# Altium project ModuloIndividualPlaza.PrjPcb
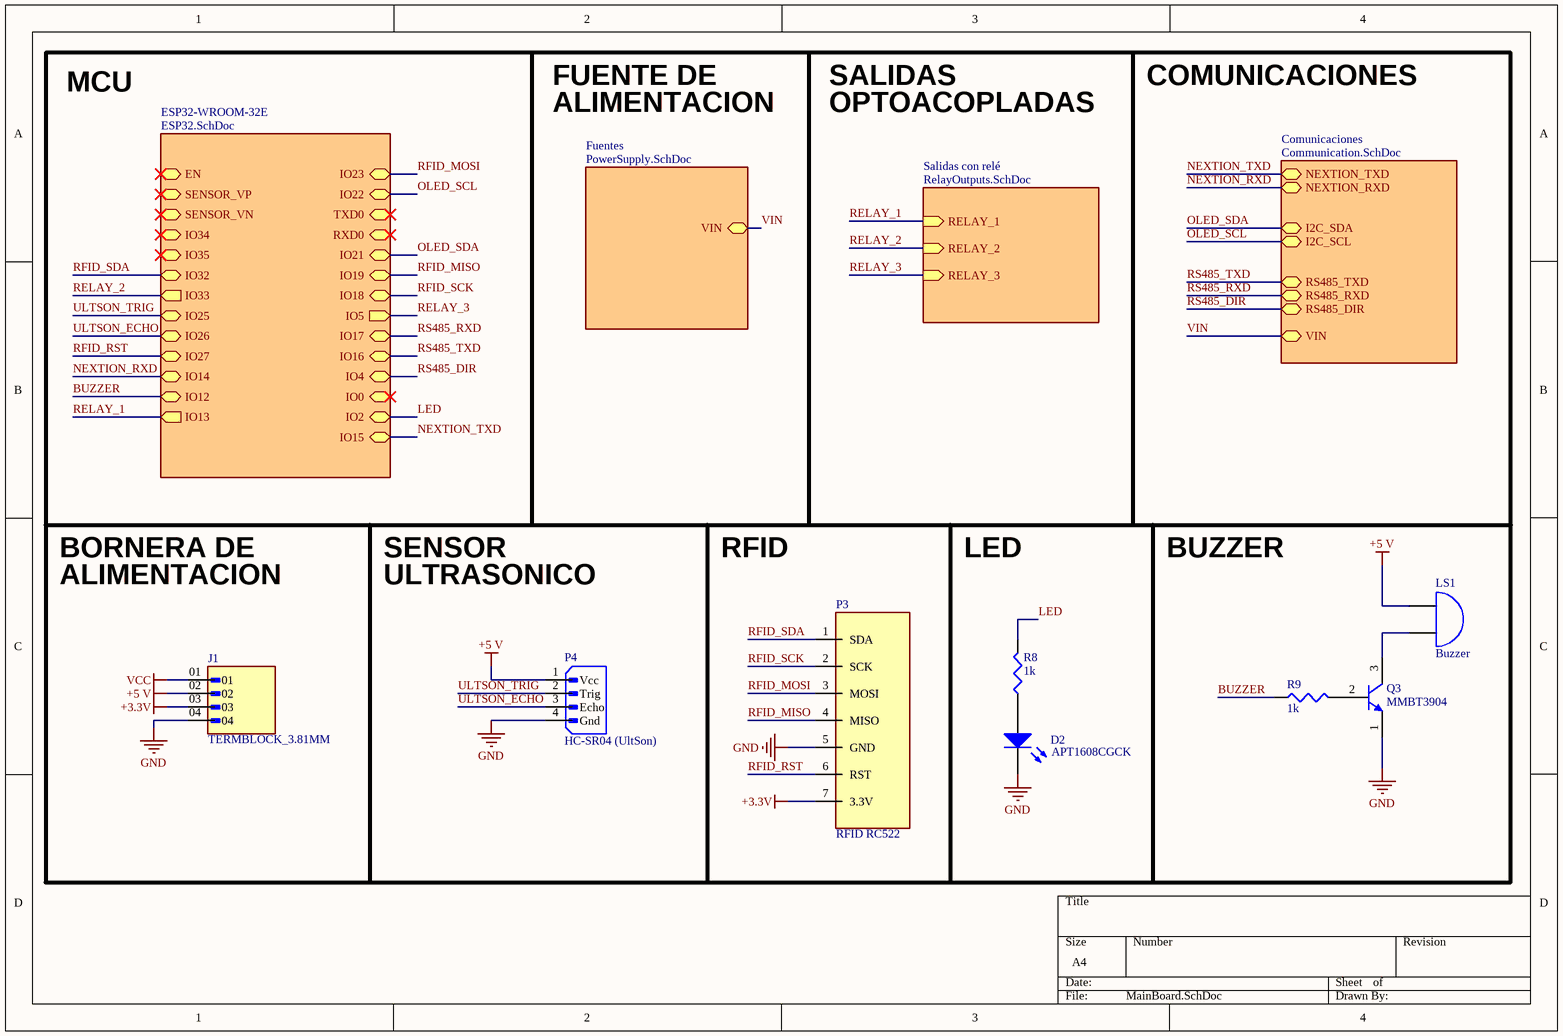
[diagram p0: MainBoard.SchDoc]
5 sheets, 77 parts. Net scope: hierarchical (ports join the sheet entries above them; power ports are global).
Board file: PCB1.PcbDoc
Sheets:
  MainBoard.SchDoc
    ESP32-WROOM-32E = ESP32.SchDoc
    Fuentes = PowerSupply.SchDoc
    Salidas con relé = RelayOutputs.SchDoc
    Comunicaciones = Communication.SchDoc

## Sheet MainBoard.SchDoc
size A4

### Parts
D2  APT1608CGCK  [ChipDiode1608]
J1  TERMBLOCK_3.81MM  [TERMBLOCK_3.81MM_90DEG_4POS]
LS1  Buzzer  [BUZZER]
P3  RFID RC522  [MOD_RFID_RC522]
P4  HC-SR04 (UltSon)  [CONN-B4B-XH-A]
Q3  MMBT3904  [MMBT3904]
R8  1k  [RESC2012N]
R9  1k  [RESC2012N]

### Sub-sheets
Comunicaciones = Communication.SchDoc: RS485_TXD, RS485_RXD, NEXTION_TXD, I2C_SDA, I2C_SCL, NEXTION_RXD, RS485_DIR, VIN
ESP32-WROOM-32E = ESP32.SchDoc: SENSOR_VN, IO34, SENSOR_VP, IO35, IO32, IO33 (out), IO25, IO26, IO27, IO14, IO12, IO13 (out), IO22, TXD0, RXD0, IO15, IO23, IO21, IO19, IO18, IO5 (out), IO17, IO16, IO4, IO0, IO2, EN
Fuentes = PowerSupply.SchDoc: VIN
Salidas con relé = RelayOutputs.SchDoc: RELAY_2 (in), RELAY_1 (in), RELAY_3 (in)

### Nets
+3.3V: J1.03 P3.7(3.3V)
+5 V: J1.02 LS1.1(A) P4.1(Vcc)
GND: D2.2(K) J1.04 P3.5(GND) P4.4(Gnd) Q3.1(E)
VCC: J1.01
BUZZER: R9.1 ; sheet ESP32-WROOM-32E/IO12
LED: R8.2 ; sheet ESP32-WROOM-32E/IO2
NEXTION_RXD: sheet ESP32-WROOM-32E/IO14, sheet Comunicaciones/NEXTION_RXD
NEXTION_TXD: sheet ESP32-WROOM-32E/IO15, sheet Comunicaciones/NEXTION_TXD
OLED_SCL: sheet ESP32-WROOM-32E/IO22, sheet Comunicaciones/I2C_SCL
OLED_SDA: sheet ESP32-WROOM-32E/IO21, sheet Comunicaciones/I2C_SDA
RELAY_1: sheet ESP32-WROOM-32E/IO13, sheet Salidas con relé/RELAY_1
RELAY_2: sheet ESP32-WROOM-32E/IO33, sheet Salidas con relé/RELAY_2
RELAY_3: sheet ESP32-WROOM-32E/IO5, sheet Salidas con relé/RELAY_3
RFID_MISO: P3.4(MISO) ; sheet ESP32-WROOM-32E/IO19
RFID_MOSI: P3.3(MOSI) ; sheet ESP32-WROOM-32E/IO23
RFID_RST: P3.6(RST) ; sheet ESP32-WROOM-32E/IO27
RFID_SCK: P3.2(SCK) ; sheet ESP32-WROOM-32E/IO18
RFID_SDA: P3.1(SDA) ; sheet ESP32-WROOM-32E/IO32
RS485_DIR: sheet ESP32-WROOM-32E/IO4, sheet Comunicaciones/RS485_DIR
RS485_RXD: sheet ESP32-WROOM-32E/IO17, sheet Comunicaciones/RS485_RXD
RS485_TXD: sheet ESP32-WROOM-32E/IO16, sheet Comunicaciones/RS485_TXD
ULTSON_ECHO: P4.3(Echo) ; sheet ESP32-WROOM-32E/IO26
ULTSON_TRIG: P4.2(Trig) ; sheet ESP32-WROOM-32E/IO25
VIN: sheet Fuentes/VIN, sheet Comunicaciones/VIN
NetD2_1: D2.1(A) R8.1
NetLS1_2: LS1.2(B) Q3.3(C)
NetQ3_2: Q3.2(B) R9.2

### Notes on the sheet
- MCU
- FUENTE DE
- ALIMENTACION
- SALIDAS
- OPTOACOPLADAS
- COMUNICACIONES
- BORNERA DE
- SENSOR
- RFID
- LED
- BUZZER
- ULTRASONICO

### Library data of the parts
D2 = LED2: LED 1.6x0.8 mm 570 nm GRN CLR SMD; Published: 8-Jun-2000; LatestRevisionDate: 17-Jul-2002; LatestRevisionNote: Re-released for DXP Platform.; PackageVersion: Feb-2002; PackageReference: 3.2X1.6X1.1; Publisher: Altium Limited; PackageDescription: SM LED; 2 Flat Leads
J1 = TERMBLOCK_3.81MM_90DEG_4POS: TERMBLOCK_3.81MM_90DEG_4POS (DigiKey: 1803293)
LS1 = Bell: Electrical Bell; Published: 24-Mar-1999; LatestRevisionDate: 17-Jul-2002; LatestRevisionNote: Re-released for DXP Platform.; PackageReference: PIN2; Publisher: Altium Limited
P3 = MOD_RFID_RC522: Módulo RFID RC522 con conector B7B-XH-A
P4 = CONN-B4B-XH-A: B4B-XH-A - CONN HEADER VERT 4POS 2.5MM
Q3 = MMBT3904: TRANS NPN 40V 0.2A SOT-23-3
R8 R9 = Res3: Resistor; Published: 8-Jun-2000; LatestRevisionDate: 29-May-2009; LatestRevisionNote: IPC-7351 Footprint Added.; PackageReference: J1-0603; Publisher: Altium Limited; PackageDescription: Chip Resistor
  R8: Value: 1K
  R9: Value: 1k

## Sheet ESP32.SchDoc: Microcontrolador
size A4; Author: Matias Herrera
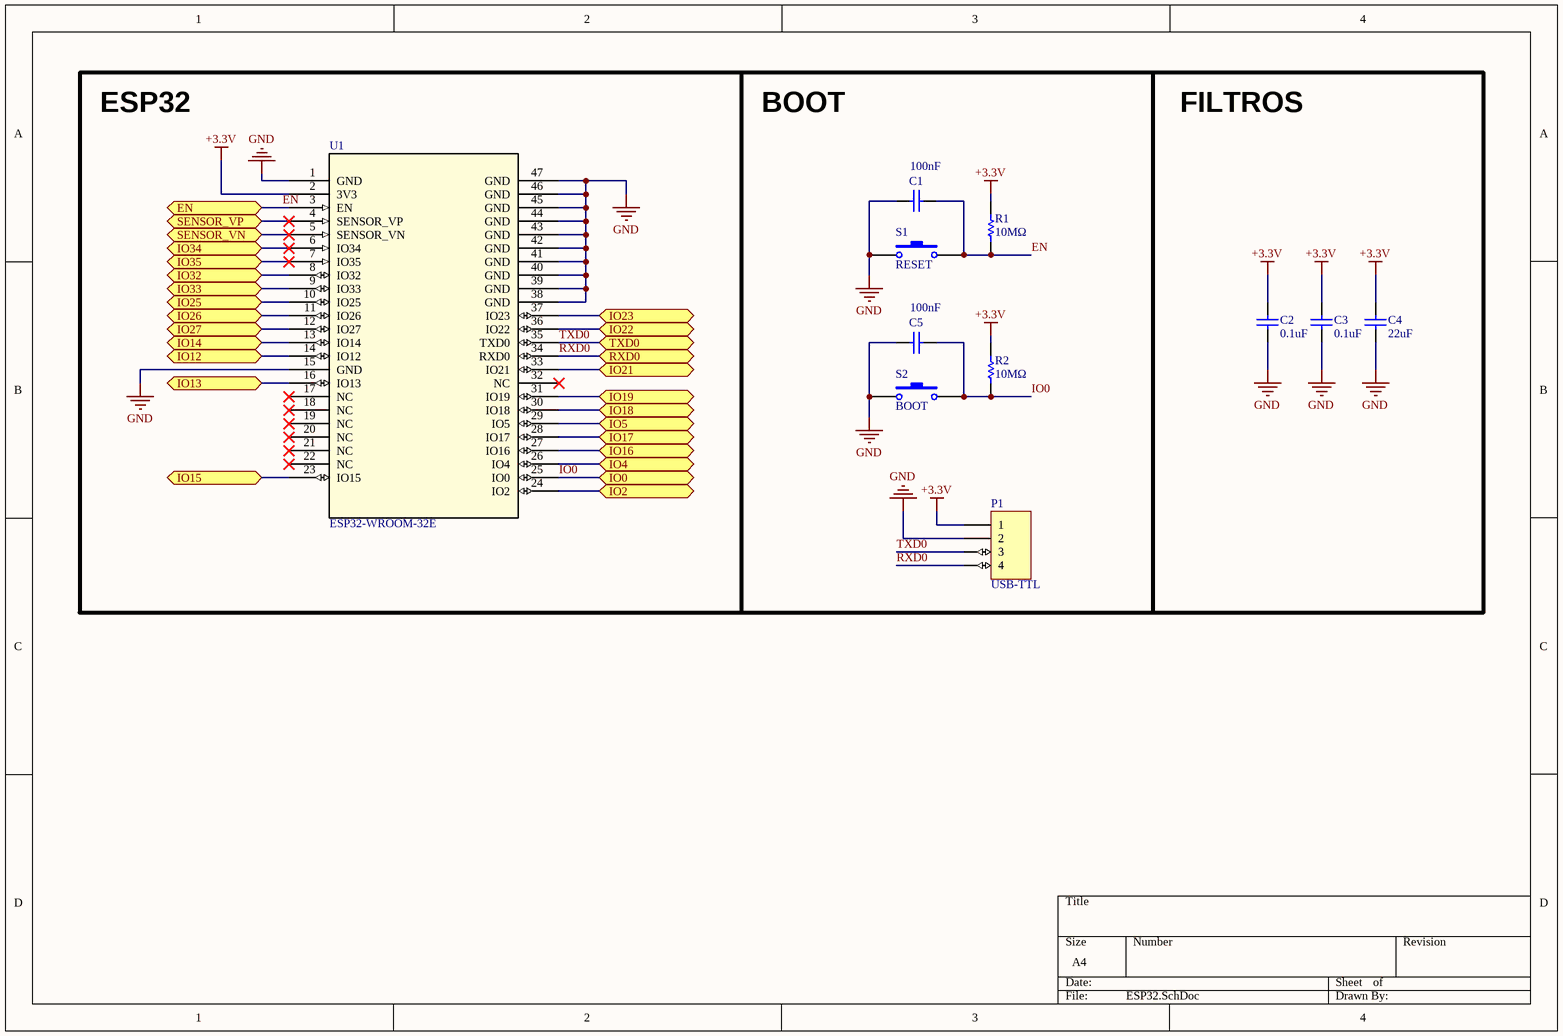
[diagram p1: ESP32.SchDoc]

### Parts
C1  100nF  [CAPC2012N]
C2  0.1uF  [CAPC2012N]
C3  0.1uF  [CAPC2012N]
C4  22uF  [CAPC2012N]
C5  100nF  [CAPC2012N]
P1  USB-TTL  [CONNHDR_1X4_2.54MM]
R1  10MΩ  [RESC2012N]
R2  10MΩ  [RESC2012N]
S1  RESET  [SWITCH TACTILE SPST-NO 0.05A 12V]
S2  BOOT  [SWITCH TACTILE SPST-NO 0.05A 12V]
U1  ESP32-WROOM-32E  [ESP32-WROOM-32E]

### Ports
EN (bidir), IO0 (bidir), IO2 (bidir), IO4 (bidir), IO5 (bidir), IO12 (bidir), IO13 (bidir), IO14 (bidir), IO15 (bidir), IO16 (bidir), IO17 (bidir), IO18 (bidir), IO19 (bidir), IO21 (bidir), IO22 (bidir), IO23 (bidir), IO25 (bidir), IO26 (bidir), IO27 (bidir), IO32 (bidir), IO33 (bidir), IO34 (bidir), IO35 (bidir), RXD0 (bidir), SENSOR_VN (bidir), SENSOR_VP (bidir), TXD0 (bidir)

### Nets
+3.3V: C2.1 C3.1 C4.1 P1.1 R1.2 R2.2 U1.2(3V3)
GND: C1.2 C2.2 C3.2 C4.2 C5.2 P1.2 S1.1 S2.1 U1.1(GND) U1.15(GND) U1.38(GND) U1.39(GND) U1.40(GND) U1.41(GND) U1.42(GND) U1.43(GND) U1.44(GND) U1.45(GND) U1.46(GND) U1.47(GND)
BUZZER: U1.14(IO12) ; port IO12
EN: C1.1 R1.1 S1.2 U1.3(EN) ; port EN
IO0: C5.1 R2.1 S2.2 U1.25(IO0) ; port IO0
LED: U1.24(IO2) ; port IO2
NEXTION_RXD: U1.13(IO14) ; port IO14
NEXTION_TXD: U1.23(IO15) ; port IO15
OLED_SCL: U1.36(IO22) ; port IO22
OLED_SDA: U1.33(IO21) ; port IO21
RELAY_1: U1.16(IO13) ; port IO13
RELAY_2: U1.9(IO33) ; port IO33
RELAY_3: U1.29(IO5) ; port IO5
RFID_MISO: U1.31(IO19) ; port IO19
RFID_MOSI: U1.37(IO23) ; port IO23
RFID_RST: U1.12(IO27) ; port IO27
RFID_SCK: U1.30(IO18) ; port IO18
RFID_SDA: U1.8(IO32) ; port IO32
RS485_DIR: U1.26(IO4) ; port IO4
RS485_RXD: U1.28(IO17) ; port IO17
RS485_TXD: U1.27(IO16) ; port IO16
RXD0: P1.4 U1.34(RXD0) ; port RXD0
TXD0: P1.3 U1.35(TXD0) ; port TXD0
ULTSON_ECHO: U1.11(IO26) ; port IO26
ULTSON_TRIG: U1.10(IO25) ; port IO25
NetU1_4: U1.4(SENSOR_VP) ; port SENSOR_VP
NetU1_5: U1.5(SENSOR_VN) ; port SENSOR_VN
NetU1_6: U1.6(IO34) ; port IO34
NetU1_7: U1.7(IO35) ; port IO35

Not connected (* = marked no-connect by the designer): U1 17(NC)* 18(NC)* 19(NC)* 20(NC)* 21(NC)* 22(NC)* 32(NC)*

### Notes on the sheet
- ESP32
- BOOT
- FILTROS

### Library data of the parts
C1 C5 = Cap: Capacitor; Published: 8-Jun-2000; LatestRevisionDate: 17-Jul-2002; LatestRevisionNote: Re-released for DXP Platform.; PackageReference: RAD-0.3; Publisher: Altium Limited; PackageDescription: Radial Cap, Thru-Hole; 2 Leads; 0.3 in Pin Spacing; Value: 100nF
C2-C4 = Cap: Capacitor; Value: 100pF; Published: 8-Jun-2000; LatestRevisionDate: 17-Jul-2002; LatestRevisionNote: Re-released for DXP Platform.; PackageReference: RAD-0.3; Publisher: Altium Limited; PackageDescription: Radial Cap, Thru-Hole; 2 Leads; 0.3 in Pin Spacing
P1 = MHDR1X4: Header, 4-Pin; LatestRevisionDate: 17-Jul-2002; LatestRevisionNote: Re-released for DXP Platform.; Publisher: Altium Limited
R1 R2 = Res1: Resistor; Value: 1M; Published: 8-Jun-2000; LatestRevisionDate: 17-Jul-2002; LatestRevisionNote: Re-released for DXP Platform.; PackageReference: AXIAL-0.3; Publisher: Altium Limited; PackageDescription: Axial Device, Thru-Hole; 2 Leads; 0.3 in Pin Spacing
S1 S2 = SW-PB: Switch; Published: 24-Mar-1999; LatestRevisionDate: 17-Jul-2002; LatestRevisionNote: Re-released for DXP Platform.; PackageReference: SPST-2; Publisher: Altium Limited; PackageDescription: Switch; 2 Leads

## Sheet PowerSupply.SchDoc
size A4
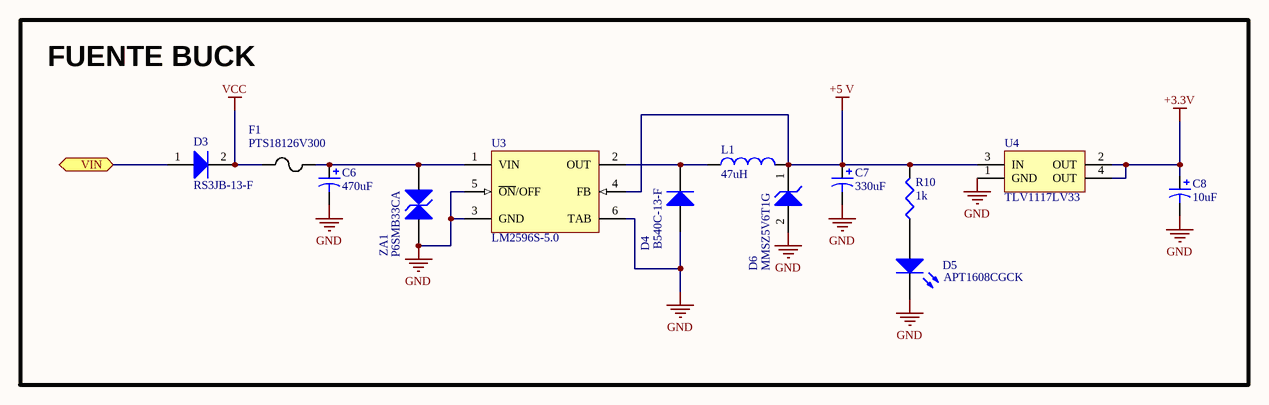
[diagram p2: PowerSupply.SchDoc]

### Parts
C6  470uF  [CapElecSMD_10mm]
C7  330uF  [CapElecSMD_8mm]
C8  10uF  [CAPC3225N]
D3  RS3JB-13-F  [SMB]
D4  B540C-13-F  [SMC]
D5  APT1608CGCK  [ChipDiode1608]
D6  MMSZ5V6T1G  [SOD-123_ONS-M]
F1  PTS18126V300  [FUSE_PTS18126_COB]
L1  47uH  [INDUCTOR_47UH_3A]
R10  1k  [RESC2012N]
U3  LM2596S-5.0  [LM2596S-5.0]
U4  TLV1117LV33  [SOT223]
ZA1  P6SMB33CA  [SMB]

### Blocks framed on the sheet
FUENTE BUCK: C6-C8 D3-D6 F1 L1 R10 U3 U4 ZA1

### Ports
VIN

### Nets
+3.3V: C8.1 U4.2(OUT) U4.4(OUT)
+5 V: C7.1 D6.1(K) L1.2 R10.2 U3.4(FB) U4.3(IN)
GND: C6.2 C7.2 C8.2 D4.1(A) D5.2(K) D6.2(A) U3.3(GND) U3.5(~{ON}/OFF) U3.6(TAB) U4.1(GND) ZA1.2
VCC: D3.2(K) F1.1
VIN: D3.1(A) ; port VIN
NetC6_1: C6.1 F1.2 U3.1(VIN) ZA1.1
NetD4_2: D4.2(K) L1.1 U3.2(OUT)
NetD5_1: D5.1(A) R10.1

### Library data of the parts
C6-C8 = Cap Pol3: Polarized Capacitor (Surface Mount); Published: 8-Jun-2000; LatestRevisionDate: 29-May-2009; LatestRevisionNote: IPC-7351 Footprint Added.; PackageReference: C0805; Publisher: Altium Limited; PackageDescription: Chip Capacitor
  C6: Value: 470uF
  C7: Value: 330uF
  C8: Value: 10uF
D3 D4 = Diode: Default Diode; Published: 8-Jun-2000; LatestRevisionDate: 17-Jul-2002; LatestRevisionNote: Re-released for DXP Platform.; PackageVersion: Sep-1996; PackageReference: SMC; Publisher: Altium Limited; PackageDescription: DO-214-AB/SMC; 2 C-Bend Leads; Body 7.9 x 5.9 mm, inc. leads (LxW); Code_JEDEC: DO-214-AB
D5 = LED2: LED 1.6x0.8 mm 570 nm GRN CLR SMD; Published: 8-Jun-2000; LatestRevisionDate: 17-Jul-2002; LatestRevisionNote: Re-released for DXP Platform.; PackageVersion: Feb-2002; PackageReference: 3.2X1.6X1.1; Publisher: Altium Limited; PackageDescription: SM LED; 2 Flat Leads
D6 = D Zener: Zener Diode; Published: 8-Jun-2000; LatestRevisionDate: 17-Jul-2002; LatestRevisionNote: Re-released for DXP Platform.; PackageReference: DIODE-0.7; Publisher: Altium Limited; PackageDescription: Diode, Thru-Hole; 2 Leads; 0.7 in Pin Spacing
F1 = PTS18126V300: PTC RESET FUSE 6V 3A 1812; Mfr_Name: Eaton
L1 = Inductor: Code_IEC: 1005; Published: 8-Jun-2000; LatestRevisionDate: 29-May-2009; LatestRevisionNote: IPC-7351 Footprint Added.; PackageReference: 0402-A; Publisher: Altium Limited; PackageDescription: Chip Inductor; Code_JEITA: 0402; Value: 47uH
R10 = Res3: Resistor; Published: 8-Jun-2000; LatestRevisionDate: 29-May-2009; LatestRevisionNote: IPC-7351 Footprint Added.; PackageReference: J1-0603; Publisher: Altium Limited; PackageDescription: Chip Resistor; Value: 1K
U3 = LM2596S-5.0: IC REG BUCK 5V 3A TO263-5L
U4 = TLV1117LV33: 1-A, Positive Fixed Voltage, Low-Dropout Regulator
ZA1 = TVS Diode: Transient voltage suppressor diode

## Sheet RelayOutputs.SchDoc
size A4
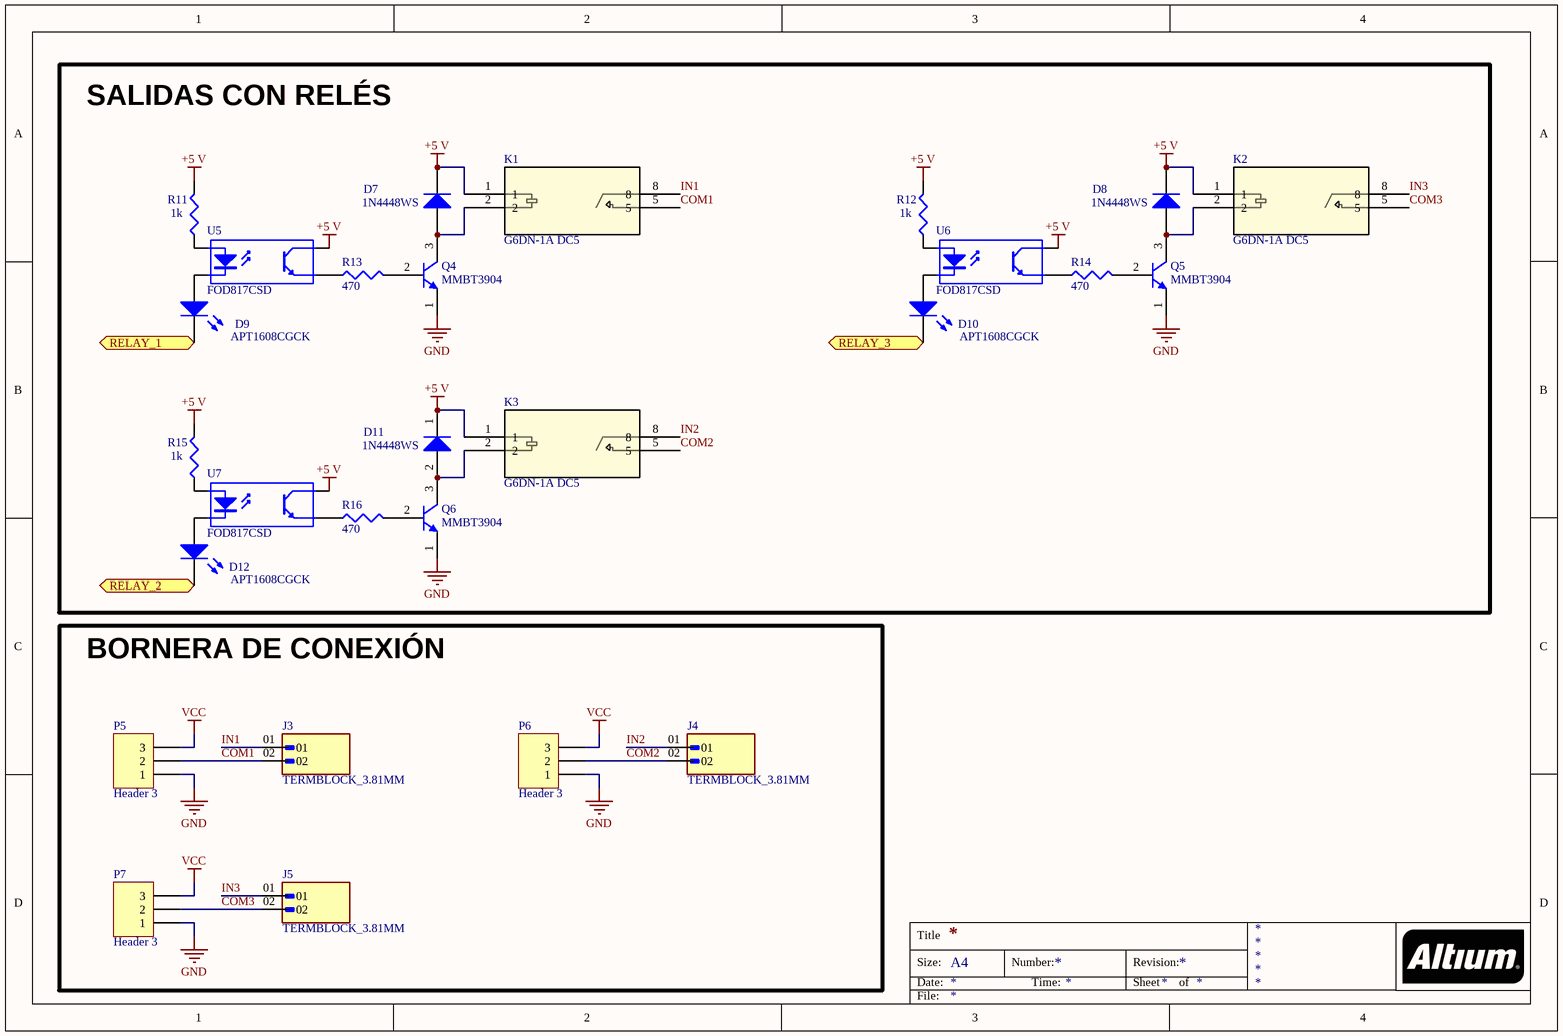
[diagram p3: RelayOutputs.SchDoc]

### Parts
D7  1N4448WS  [SOD-323]
D8  1N4448WS  [SOD-323]
D9  APT1608CGCK  [ChipDiode1608]
D10  APT1608CGCK  [ChipDiode1608]
D11  1N4448WS  [SOD-323]
D12  APT1608CGCK  [ChipDiode1608]
J3  TERMBLOCK_3.81MM  [TERMBLOCK_3.81MM_90DEG_2POS]
J4  TERMBLOCK_3.81MM  [TERMBLOCK_3.81MM_90DEG_2POS]
J5  TERMBLOCK_3.81MM  [TERMBLOCK_3.81MM_90DEG_2POS]
K1  G6DN-1A DC5  [RELAY_G6DN-1A_OMR]
K2  G6DN-1A DC5  [RELAY_G6DN-1A_OMR]
K3  G6DN-1A DC5  [RELAY_G6DN-1A_OMR]
P5  Header 3  [CONNHDR_1X3_2.54MM]
P6  Header 3  [CONNHDR_1X3_2.54MM]
P7  Header 3  [CONNHDR_1X3_2.54MM]
Q4  MMBT3904  [MMBT3904]
Q5  MMBT3904  [MMBT3904]
Q6  MMBT3904  [MMBT3904]
R11  1k  [RESC2012N]
R12  1k  [RESC2012N]
R13  470  [RESC2012N]
R14  470  [RESC2012N]
R15  1k  [RESC2012N]
R16  470  [RESC2012N]
U5  FOD817CSD  [OPTOISOLATOR 5KV TRANSISTOR 4SMD]
U6  FOD817CSD  [OPTOISOLATOR 5KV TRANSISTOR 4SMD]
U7  FOD817CSD  [OPTOISOLATOR 5KV TRANSISTOR 4SMD]

### Blocks framed on the sheet
SALIDAS CON RELÉS: D7-D12 K1-K3 Q4-Q6 R11-R16 U5-U7
BORNERA DE CONEXIÓN: J3-J5 P5-P7

### Ports
RELAY_1 (bidir), RELAY_2 (bidir), RELAY_3 (bidir)

### Nets
+5 V: D7.1(K) D8.1(K) D11.1(K) K1.1 K2.1 K3.1 R11.2 R12.2 R15.2 U5.4(C) U6.4(C) U7.4(C)
GND: P5.1 P6.1 P7.1 Q4.1(E) Q5.1(E) Q6.1(E)
VCC: P5.3 P6.3 P7.3
COM1: J3.02 K1.5 P5.2
COM2: J4.02 K3.5 P6.2
COM3: J5.02 K2.5 P7.2
IN1: J3.01 K1.8
IN2: J4.01 K3.8
IN3: J5.01 K2.8
RELAY_1: D9.2(K) ; port RELAY_1
RELAY_2: D12.2(K) ; port RELAY_2
RELAY_3: D10.2(K) ; port RELAY_3
NetD7_2: D7.2(A) K1.2 Q4.3(C)
NetD8_2: D8.2(A) K2.2 Q5.3(C)
NetD9_1: D9.1(A) U5.2(K)
NetD10_1: D10.1(A) U6.2(K)
NetD11_2: D11.2(A) K3.2 Q6.3(C)
NetD12_1: D12.1(A) U7.2(K)
NetQ4_2: Q4.2(B) R13.2
NetQ5_2: Q5.2(B) R14.2
NetQ6_2: Q6.2(B) R16.2
NetR11_1: R11.1 U5.1(A)
NetR12_1: R12.1 U6.1(A)
NetR13_1: R13.1 U5.3(E)
NetR14_1: R14.1 U6.3(E)
NetR15_1: R15.1 U7.1(A)
NetR16_1: R16.1 U7.3(E)

### Notes on the sheet
- Title
- Size:
- Date:
- A4
- Number:
- Time:
- Revision:
- Sheet
- of
- File:

### Library data of the parts
D7 D8 D11 = Diode: Default Diode; Published: 8-Jun-2000; LatestRevisionDate: 17-Jul-2002; LatestRevisionNote: Re-released for DXP Platform.; PackageVersion: Sep-1996; PackageReference: SMC; Publisher: Altium Limited; PackageDescription: DO-214-AB/SMC; 2 C-Bend Leads; Body 7.9 x 5.9 mm, inc. leads (LxW); Code_JEDEC: DO-214-AB
D9 D10 D12 = LED2: LED 1.6x0.8 mm 570 nm GRN CLR SMD; Published: 8-Jun-2000; LatestRevisionDate: 17-Jul-2002; LatestRevisionNote: Re-released for DXP Platform.; PackageVersion: Feb-2002; PackageReference: 3.2X1.6X1.1; Publisher: Altium Limited; PackageDescription: SM LED; 2 Flat Leads
J3-J5 = TERMBLOCK_3.81MM_90DEG_2POS: TERMBLOCK_3.81MM_90DEG_2POS (DigiKey: 1803277)
K1-K3 = G6DN-1A DC5: Rele_Omron_5V_5A; Mfr_Name: Omron; RefDes: RefDes; Type: Type
P5-P7 = Header 3: Header, 3-Pin; LatestRevisionDate: 17-Jul-2002; LatestRevisionNote: Re-released for DXP Platform.; Publisher: Altium Limited
Q4-Q6 = MMBT3904: TRANS NPN 40V 0.2A SOT-23-3
R11 R12 R15 = Res3: Resistor; Published: 8-Jun-2000; LatestRevisionDate: 29-May-2009; LatestRevisionNote: IPC-7351 Footprint Added.; PackageReference: J1-0603; Publisher: Altium Limited; PackageDescription: Chip Resistor; Value: 1k
R13 R14 R16 = Res3: Resistor; Value: 510; Published: 8-Jun-2000; LatestRevisionDate: 29-May-2009; LatestRevisionNote: IPC-7351 Footprint Added.; PackageReference: J1-0603; Publisher: Altium Limited; PackageDescription: Chip Resistor
U5-U7 = Optoisolator1: 4-Pin Phototransistor Optocoupler; Published: 24-Mar-1999; LatestRevisionDate: 04-Mar-2005; LatestRevisionNote: Sch pins 3 & 4 Swapped.; DatasheetVersion: Nov-2003; PackageReference: DIP-4; Publisher: Altium Limited

## Sheet Communication.SchDoc
size A4; ApprovedBy: G. Zeitune; CheckedBy: J. Fiszman; DrawnBy: M. Mainenti; DocumentNumber: 1; Revision: 2; SheetNumber: 1; SheetTotal: 1
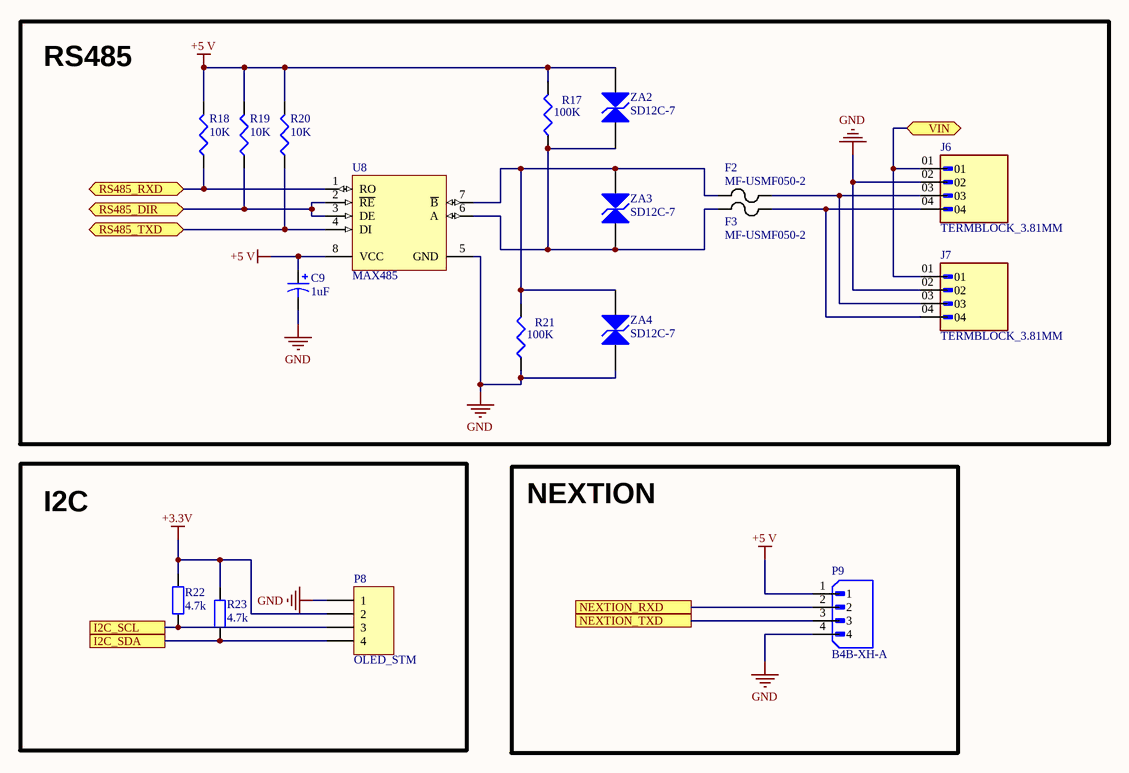
[diagram p4: Communication.SchDoc]

### Parts
C9  1uF  [CAPC3225N]
F2  MF-USMF050-2  [MF-USMF050-2]
F3  MF-USMF050-2  [MF-USMF050-2]
J6  TERMBLOCK_3.81MM  [TERMBLOCK_3.81MM_90DEG_4POS]
J7  TERMBLOCK_3.81MM  [TERMBLOCK_3.81MM_90DEG_4POS]
P8  OLED_STM  [CONNHDR_1X4_2.54MM]
P9  B4B-XH-A  [CONN-B4B-XH-A]
R17  100K  [RESC2012N]
R18  10K  [RESC2012N]
R19  10K  [RESC2012N]
R20  10K  [RESC2012N]
R21  100K  [RESC2012N]
R22  4.7k  [RESC2012N]
R23  4.7k  [RESC2012N]
U8  MAX485  [MAX485]
ZA2  SD12C-7  [SOD-323]
ZA3  SD12C-7  [SOD-323]
ZA4  SD12C-7  [SOD-323]

### Blocks framed on the sheet
RS485: C9 F2 F3 J6 J7 R17-R21 U8 ZA2-ZA4
I2C: P8 R22 R23
NEXTION: P9

### Ports
I2C_SCL, I2C_SDA, NEXTION_RXD, NEXTION_TXD, RS485_DIR (bidir), RS485_RXD (bidir), RS485_TXD (bidir), VIN

### Nets
+3.3V: P8.2 R22.2 R23.2
+5 V: C9.1 P9.1 R17.2 R18.2 R19.2 R20.2 U8.8(VCC) ZA2.1
GND: C9.2 J6.02 J7.02 P8.1 P9.4 R21.1 U8.5(GND) ZA4.2
NEXTION_RXD: P9.2 ; port NEXTION_RXD
NEXTION_TXD: P9.3 ; port NEXTION_TXD
OLED_SCL: P8.3 R22.1 ; port I2C_SCL
OLED_SDA: P8.4 R23.1 ; port I2C_SDA
RS485_DIR: R19.1 U8.2(~{RE}) U8.3(DE) ; port RS485_DIR
RS485_RXD: R18.1 U8.1(RO) ; port RS485_RXD
RS485_TXD: R20.1 U8.4(DI) ; port RS485_TXD
VIN: J6.01 J7.01 ; port VIN
NetF2_1: F2.1 R21.2 U8.7(~{B}) ZA3.1 ZA4.1
NetF2_2: F2.2 J6.03 J7.03
NetF3_1: F3.1 R17.1 U8.6(A) ZA2.2 ZA3.2
NetF3_2: F3.2 J6.04 J7.04

### Notes on the sheet
- Title
- Size:
- Date:
- A4
- Number:
- Time:
- Revision:
- Sheet
- of
- File:

### Library data of the parts
C9 = Cap Pol3: Polarized Capacitor (Surface Mount); Value: 0.1uF; Published: 8-Jun-2000; LatestRevisionDate: 29-May-2009; LatestRevisionNote: IPC-7351 Footprint Added.; PackageReference: C0805; Publisher: Altium Limited; PackageDescription: Chip Capacitor
F2 F3 = PTS18126V300: as F1 on sheet PowerSupply
J6 J7 = TERMBLOCK_3.81MM_90DEG_4POS: as J1 on sheet MainBoard
P8 = MHDR1X4: Header, 4-Pin; LatestRevisionDate: 17-Jul-2002; LatestRevisionNote: Re-released for DXP Platform.; Publisher: Altium Limited
P9 = CONN-B4B-XH-A: CONN HEADER VERT 4POS 2.5MM
R17-R21 = Res3: Resistor; Published: 8-Jun-2000; LatestRevisionDate: 29-May-2009; LatestRevisionNote: IPC-7351 Footprint Added.; PackageReference: J1-0603; Publisher: Altium Limited; PackageDescription: Chip Resistor
  R17 R21: Value: 100K
  R18-R20: Value: 10K
R22 R23 = Res2: Resistor; Value: 1K; Published: 8-Jun-2000; LatestRevisionDate: 17-Jul-2002; LatestRevisionNote: Re-released for DXP Platform.; PackageReference: AXIAL-0.4; Publisher: Altium Limited; PackageDescription: Axial Device, Thru-Hole; 2 Leads; 0.4 in Pin Spacing
U8 = MAX485: Low-Power RS-485/RS-422 Multipoint Transceiver, 8-pin Narrow SOIC
ZA2-ZA4 = TVS Diode: Transient voltage suppressor diode

## Nets that join several sheets
+3.3V: MainBoard (J1.03 P3.7), ESP32 (7 pins), PowerSupply (C8.1 U4.2 U4.4), Communication (P8.2 R22.2 R23.2)
+5 V: MainBoard (J1.02 LS1.1 P4.1), PowerSupply (6 pins), RelayOutputs (12 pins), Communication (8 pins)
GND: MainBoard (5 pins), ESP32 (20 pins), PowerSupply (11 pins), RelayOutputs (6 pins), Communication (8 pins)
VCC: MainBoard (J1.01), PowerSupply (D3.2 F1.1), RelayOutputs (P5.3 P6.3 P7.3)
BUZZER: MainBoard (R9.1), ESP32 (U1.14)
LED: MainBoard (R8.2), ESP32 (U1.24)
NEXTION_RXD: ESP32 (U1.13), Communication (P9.2)
NEXTION_TXD: ESP32 (U1.23), Communication (P9.3)
OLED_SCL: ESP32 (U1.36), Communication (P8.3 R22.1)
OLED_SDA: ESP32 (U1.33), Communication (P8.4 R23.1)
RELAY_1: ESP32 (U1.16), RelayOutputs (D9.2)
RELAY_2: ESP32 (U1.9), RelayOutputs (D12.2)
RELAY_3: ESP32 (U1.29), RelayOutputs (D10.2)
RFID_MISO: MainBoard (P3.4), ESP32 (U1.31)
RFID_MOSI: MainBoard (P3.3), ESP32 (U1.37)
RFID_RST: MainBoard (P3.6), ESP32 (U1.12)
RFID_SCK: MainBoard (P3.2), ESP32 (U1.30)
RFID_SDA: MainBoard (P3.1), ESP32 (U1.8)
RS485_DIR: ESP32 (U1.26), Communication (R19.1 U8.2 U8.3)
RS485_RXD: ESP32 (U1.28), Communication (R18.1 U8.1)
RS485_TXD: ESP32 (U1.27), Communication (R20.1 U8.4)
ULTSON_ECHO: MainBoard (P4.3), ESP32 (U1.11)
ULTSON_TRIG: MainBoard (P4.2), ESP32 (U1.10)
VIN: PowerSupply (D3.1), Communication (J6.01 J7.01)